# Altium schematic sheet CYLINDERS.SchDoc: CYLINDERS
size 558 x 401 mm; Organization: Carnegie Institution of Washington; DocumentNumber: 5; SheetNumber: 5; SheetTotal: 8; PageSetup: Record=PageOptions|CenterHorizontal=True|CenterVertical=True|PrintScale=0.47|XCorrection=1.00|YCorrection=1.00|PrintKind=0|BorderSize=5000000|LeftOffset=0|BottomOffset=0|Orientation=2|PaperLength=1000|PaperWidth=1000|Scale=100|PaperSource=259|PrintQuality=600|MediaType=1|DitherType=10|PaperKind=Letter (8.5 x 11")|PrintScaleMode=1; DocumentName: CYLINDERS
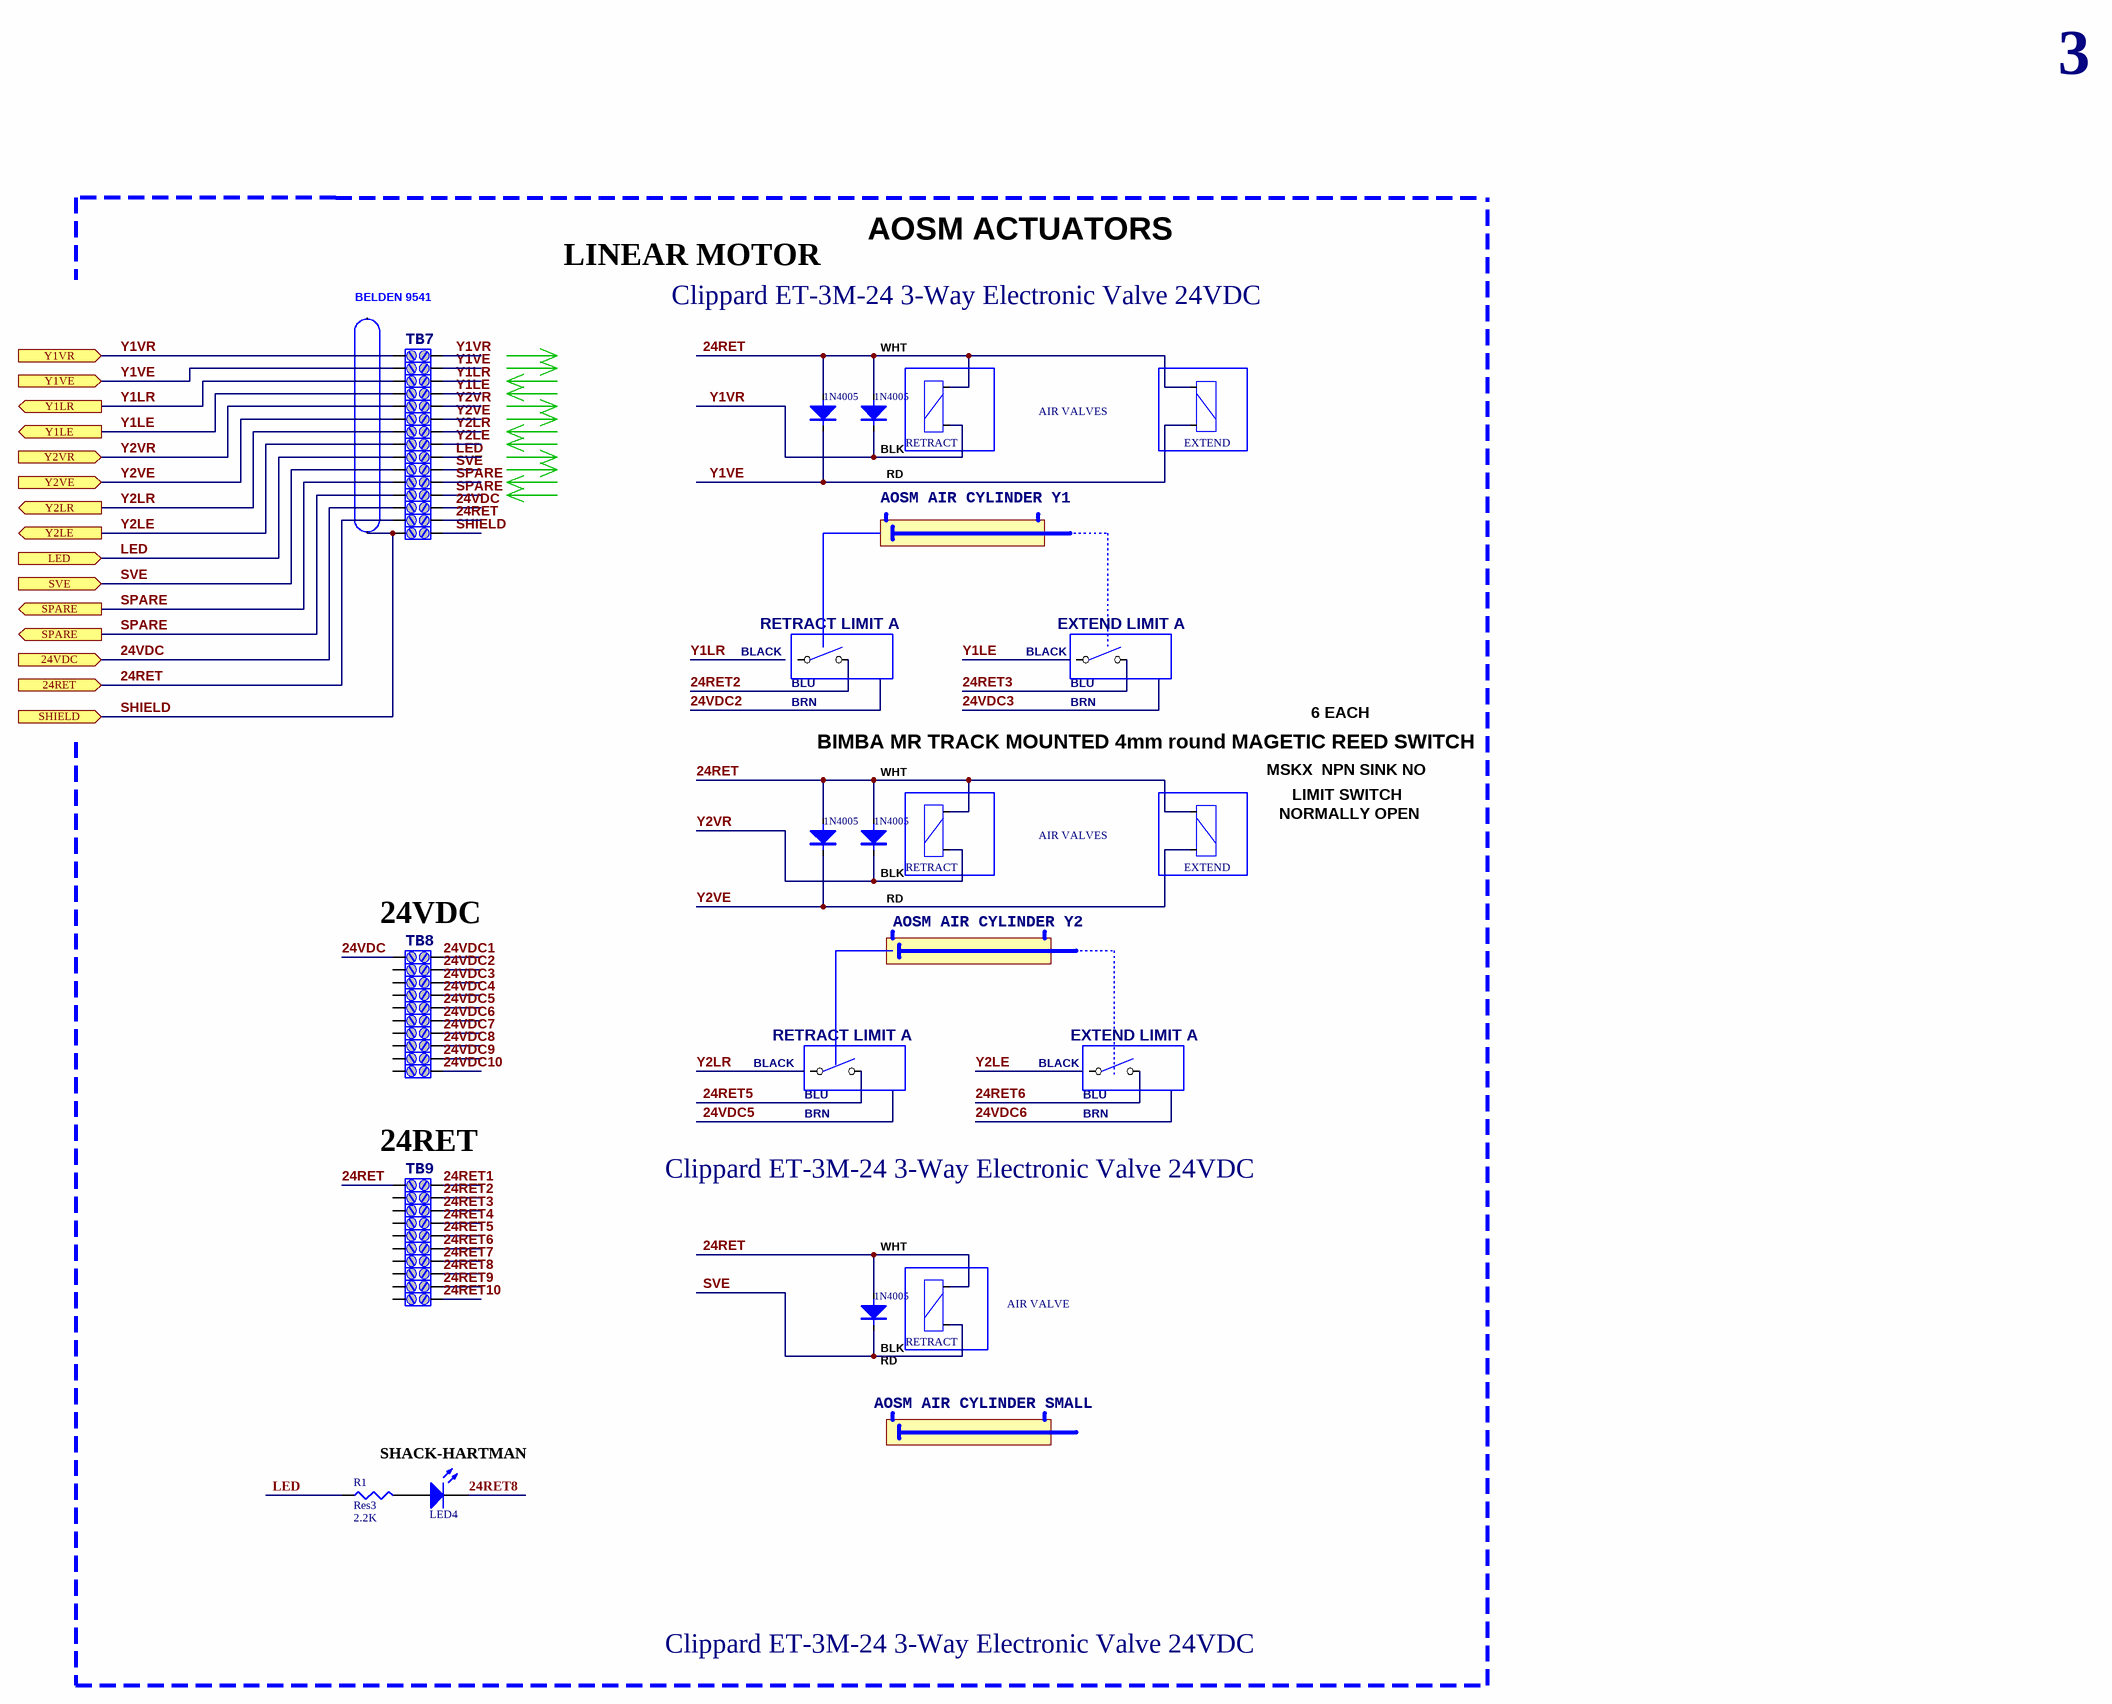
[diagram p0: CYLINDERS.SchDoc]

## Parts
(Parts that share a designator on the sheet are numbered #1, #2 ... from top to bottom, then left to right.)
?#1  (no value)
?#2  (no value)
?#3  (no value)
?#4  (no value)
?#5  RETRACT
?#6  (no value)
?#7  1N4005
?#8  1N4005
?#9  (no value)
?#10  (no value)
?#11  (no value)
?#12  (no value)
?#13  (no value)
?#14  (no value)
?#15  (no value)
?#16  (no value)
?#17  (no value)
?#18  (no value)
?#19  (no value)
?#20  (no value)
?#21  (no value)
?#22  RETRACT
?#23  1N4005
?#24  1N4005
?#25  (no value)
?#26  (no value)
?#27  (no value)
?#28  (no value)
?#29  (no value)
?#30  (no value)
?#31  (no value)
?#32  (no value)
?#33  (no value)
?#34  (no value)
?#35  (no value)
?#36  (no value)
?#37  (no value)
?#38  (no value)
?#39  (no value)
?#40  (no value)
?#41  (no value)
?#42  (no value)
?#43  (no value)
?#44  (no value)
?#45  RETRACT  S: AIR VALVE
?#46  1N4005
AIR_VALVES#1  EXTEND
AIR_VALVES#2  EXTEND
AOSM_AIR_CYLINDER_SMALL  (no value)
AOSM_AIR_CYLINDER_Y1  (no value)
AOSM_AIR_CYLINDER_Y2  (no value)
D?  LED4  [LED-0]
R1  Res3  value 2.2K  [J1-0603]
TB7  (no value)
TB8  (no value)
TB9  (no value)

## Ports
24RET, 24VDC, LED, SHIELD, SPARE, SVE, Y1LE, Y1LR, Y1VE, Y1VR, Y2LE, Y2LR, Y2VE, Y2VR

## Nets
24RET: ?#5.10(-) ?#7.1(A) ?#8.1(A) ?#18.1 ?#18.2 ?#22.10(-) ?#23.1(A) ?#24.1(A) ?#45.10(-) ?#46.1(A) AIR_VALVES#1.10(-) AIR_VALVES#2.10(-) TB9.2 ; port 24RET
24RET1: TB9.1
24RET2: ?#20.2 ?#36.1
24RET3: ?#21.2 ?#37.1
24RET4: ?#38.1
24RET5: ?#34.2 ?#39.1
24RET6: ?#35.2 ?#40.1
24RET7: ?#41.1
24RET8: ?#42.1 D?.2(K)
24RET9: ?#43.1
24RET10: ?#44.1
24VDC: ?#16.1 ?#16.2 TB8.2 ; port 24VDC
24VDC1: TB8.1
24VDC2: ?#25.1
24VDC3: ?#26.1
24VDC4: ?#27.1
24VDC5: ?#28.1
24VDC6: ?#29.1
24VDC7: ?#30.1
24VDC8: ?#31.1
24VDC9: ?#32.1
24VDC10: ?#33.1
LED: ?#12.1 ?#12.2 R1.1 ; port LED
SHIELD: ?#17.29(SENCE_HI) ?#19.1 ?#19.2 ; port SHIELD
SPARE: ?#14.1 ?#14.2 ?#15.1 ?#15.2 ; port SPARE
SVE: ?#13.1 ?#13.2 ?#45.2(+) ?#46.2(K) ; port SVE
Y1LE: ?#4.1 ?#4.2 ; port Y1LE
Y1LR: ?#3.1 ?#3.2 ; port Y1LR
Y1VE: ?#2.1 ?#2.2 ?#7.2(K) AIR_VALVES#1.2(+) ; port Y1VE
Y1VR: ?#5.2(+) ?#8.2(K) TB7.1 TB7.2 ; port Y1VR
Y2LE: ?#11.1 ?#11.2 ; port Y2LE
Y2LR: ?#10.1 ?#10.2 ; port Y2LR
Y2VE: ?#9.1 ?#9.2 ?#23.2(K) AIR_VALVES#2.2(+) ; port Y2VE
Y2VR: ?#6.1 ?#6.2 ?#22.2(+) ?#24.2(K) ; port Y2VR
NetD?_1: D?.1(A) R1.2

Not connected (* = marked no-connect by the designer): ?#1 29(SENCE_HI); ?#20 1; ?#21 1; ?#25 2; ?#26 2; ?#27 2; ?#28 2; ?#29 2; ?#30 2; ?#31 2; ?#32 2; ?#33 2; ?#34 1; ?#35 1; ?#36 2; ?#37 2; ?#38 2; ?#39 2; ?#40 2; ?#41 2; ?#42 2; ?#43 2; ?#44 2

## Notes on the sheet
- 3
- LINEAR MOTOR
- AOSM ACTUATORS
- BELDEN 9541
- Clippard ET-3M-24 3-Way Electronic Valve 24VDC
- WHT
- BLK
- RD
- BLACK
- RETRACT LIMIT A
- EXTEND LIMIT A
- BLU
- BRN
- 6 EACH
- BIMBA MR TRACK MOUNTED 4mm round MAGETIC REED SWITCH
- MSKX  NPN SINK NO
- NORMALLY OPEN
- LIMIT SWITCH
- (near TB8) 24VDC
- (near TB9) 24RET
- SHACK-HARTMAN
- Carnegie Institution of Washington
- 813 Santa Barbara Street
- The Observatories
- PHONE (626) 577-1122               FAX (626) 795-8136
- Pasadena, California 91101
- Title:
- OCIW
- Size:
- Date:
- C
- Scale:
- Drawn By:
- Checked By:
- A. BAGISH
- alanb
- Revision:
- Sheet          of
- File:

## Library data of the parts
?#1 ?#17 = ARC
?#2 ?#25 ?#36 = TB3: Part Field 1: 23; Part Field 2: 24
?#3 ?#26 ?#37 = TB3: Part Field 1: 25; Part Field 2: 26
?#4 ?#27 ?#38 = TB3: Part Field 1: 27; Part Field 2: 28
?#5 ?#22 ?#45 AIR_VALVES#1 AIR_VALVES#2 = COIL2
?#6 ?#28 ?#39 = TB3: Part Field 1: 29; Part Field 2: 30
?#7 ?#8 ?#23 ?#24 ?#46 = DIODE(SHORT)
?#9 ?#29 ?#40 = TB3: Part Field 1: 31; Part Field 2: 32
?#10 ?#30 ?#41 = TB3: Part Field 1: 33; Part Field 2: 34
?#11 ?#31 ?#42 = TB3: Part Field 1: 35; Part Field 2: 36
?#12 ?#32 ?#43 = TB3: Part Field 1: 37; Part Field 2: 38
?#13-?#16 ?#18 ?#19 ?#33 ?#44 = TB3: Part Field 1: 39; Part Field 2: 40
?#20 ?#21 ?#34 ?#35 = SW-SPST
AOSM_AIR_CYLINDER_SMALL AOSM_AIR_CYLINDER_Y1 AOSM_AIR_CYLINDER_Y2 = AIR CYL LONG IN
D? = LED0: Typical INFRARED GaAs LED; Manuf #: 607-1212-120F; Published: 8-Jun-2000; LatestRevisionDate: 08-Jul-2005; LatestRevisionNote: Mech Layer 1 removed.; PackageReference: LED-0; Publisher: Altium Limited
R1 = Res3: Resistor; Published: 8-Jun-2000; LatestRevisionDate: 04-Mar-2005; LatestRevisionNote: PCB Footprint replaced.; PackageReference: J1-0603; Publisher: Altium Limited
TB7-TB9 = TB3: Part Field 1: 21; Part Field 2: 22